# Altium project ChristmasLightNode.PrjPCB
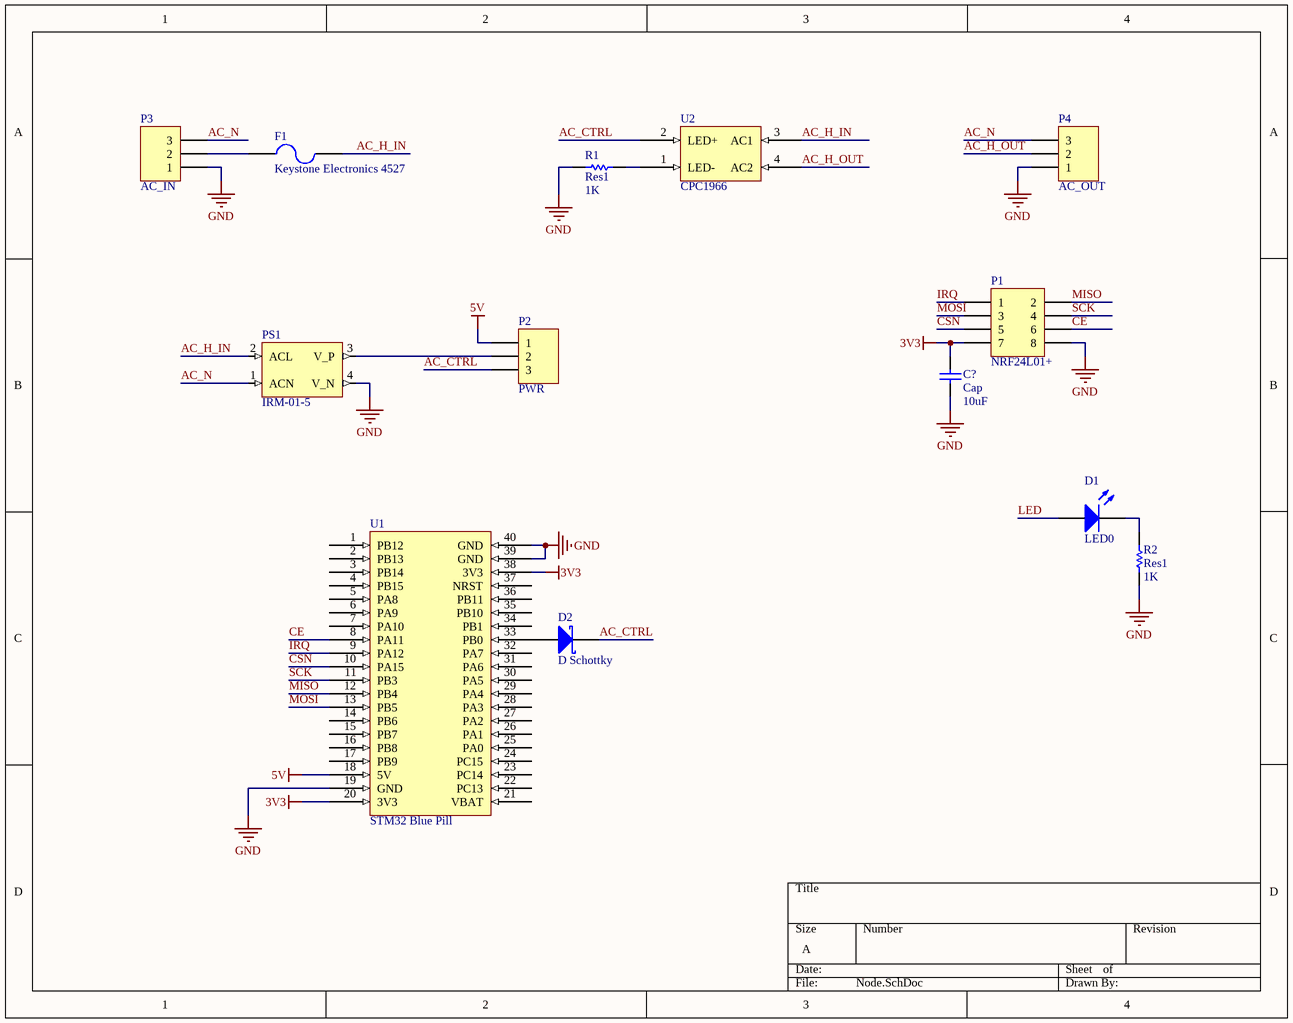
[diagram p0: Node.SchDoc]
1 sheet, 13 parts. Net scope: global (net labels, ports and power ports of the same name join across sheets).
Board file: NodePCB.PcbDoc

## Sheet Node.SchDoc
size A

### Parts
C?  Cap  value 10uF  [RAD-0.3]
D1  LED0  [LED-0]
D2  D Schottky  [SMB]
F1  Keystone Electronics 4527  [PIN-W2/E2.8]
P1  NRF24L01+  [HDR2X4]
P2  PWR  [HDR1X3]
P3  AC_IN  [HDR1X3]
P4  AC_OUT  [HDR1X3]
PS1  IRM-01-5  [CONV_IRM-01-5]
R1  Res1  value 1K  [AXIAL-0.3]
R2  Res1  value 1K  [AXIAL-0.3]
U1  STM32 Blue Pill
U2  CPC1966

### Nets
3V3: C?.2 P1.7 U1.20(3V3) U1.38(3V3)
5V: P2.1 U1.18(5V)
GND: C?.1 P1.8 P3.1 P4.1 PS1.4(V_N) R1.1 R2.1 U1.19(GND) U1.39(GND) U1.40(GND)
AC_CTRL: D2.2(K) P2.3 U2.2(LED+)
AC_H_IN: F1.2 PS1.2(ACL) U2.3(AC1)
AC_H_OUT: P4.2 U2.4(AC2)
AC_N: P3.3 P4.3 PS1.1(ACN)
CE: P1.6 U1.8(PA11)
CSN: P1.5 U1.10(PA15)
IRQ: P1.1 U1.9(PA12)
LED: D1.1(A)
MISO: P1.2 U1.12(PB4)
MOSI: P1.3 U1.13(PB5)
SCK: P1.4 U1.11(PB3)
NetD1_2: D1.2(K) R2.2
NetD2_1: D2.1(A) U1.33(PB0)
NetF1_1: F1.1 P3.2
NetP2_2: P2.2 PS1.3(V_P)
NetR1_2: R1.2 U2.1(LED-)

Not connected (* = marked no-connect by the designer): U1 1(PB12) 2(PB13) 3(PB14) 4(PB15) 5(PA8) 6(PA9) 7(PA10) 14(PB6) 15(PB7) 16(PB8) 17(PB9) 21(VBAT) 22(PC13) 23(PC14) 24(PC15) 25(PA0) 26(PA1) 27(PA2) 28(PA3) 29(PA4) 30(PA5) 31(PA6) 32(PA7) 34(PB1) 35(PB10) 36(PB11) 37(NRST)

### Library data of the parts
C? = Cap: Capacitor; Published: 8-Jun-2000; LatestRevisionDate: 17-Jul-2002; LatestRevisionNote: Re-released for DXP Platform.; PackageReference: RAD-0.3; Publisher: Altium Limited; PackageDescription: Radial Cap, Thru-Hole; 2 Leads; 0.3 in Pin Spacing
D1 = LED0: Typical INFRARED GaAs LED; Published: 8-Jun-2000; LatestRevisionDate: 08-Jul-2005; LatestRevisionNote: Mech Layer 1 removed.; PackageReference: LED-0; Publisher: Altium Limited; PackageDescription: LED; 2 Leads
D2 = D Schottky: Schottky Diode; Published: 8-Jun-2000; LatestRevisionDate: 17-Jul-2002; LatestRevisionNote: Re-released for DXP Platform.; PackageReference: SMB; Publisher: Altium Limited; PackageDescription: DO-214-AA/SMB; 2 C-Bend Leads; Body 5.3 x 3.6 mm, inc. leads (LxW); Code_JEDEC: DO-214-AA
F1 = Fuse 2: Fuse; Published: 8-Jun-2000; LatestRevisionDate: 17-Jul-2002; LatestRevisionNote: Re-released for DXP Platform.; PackageReference: PIN-W2/E2.8; Publisher: Altium Limited; PackageDescription: Thru-Hole; 2 Leads
P1 = Header 4X2: Header, 4-Pin, Dual row; LatestRevisionDate: 17-Jul-2002; LatestRevisionNote: Re-released for DXP Platform.; Publisher: Altium Limited
P2-P4 = Header 3: Header, 3-Pin; LatestRevisionDate: 17-Jul-2002; LatestRevisionNote: Re-released for DXP Platform.; Publisher: Altium Limited
PS1 = IRM-01-5: AC-DC Single Output Encapsulated power supply; Input 85-305Vac; Output 5Vdc at 0.2A; PCB mount; MF: MEAN WELL; Price: None; Package: DIP-4 Mean Well; MP: IRM-01-5; Availability: Unavailable; SnapEDA_Link: https://www.snapeda.com/parts/IRM-01-5/MEAN%20WELL%20USA%20Inc./view-part/?ref=snap; Value: *
R1 R2 = Res1: Resistor; Published: 8-Jun-2000; LatestRevisionDate: 17-Jul-2002; LatestRevisionNote: Re-released for DXP Platform.; PackageReference: AXIAL-0.3; Publisher: Altium Limited; PackageDescription: Axial Device, Thru-Hole; 2 Leads; 0.3 in Pin Spacing
U1 = BluePill: STM32F103 Blue Pill
U2 = CPC1966: SSR RELAY SPST-NO 3A 20-240V